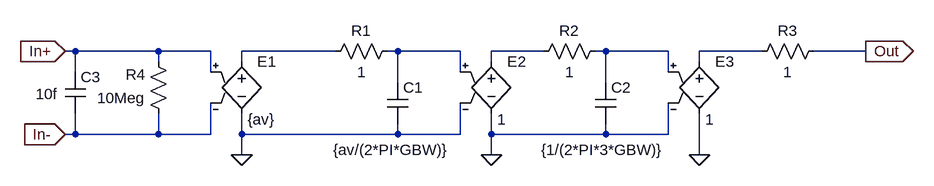
[diagram p0: schematic AO_2poles.asc]
AO_2poles.asc, the LTspice schematic file:
Version 4
SHEET 1 1188 680
WIRE -128 96 -144 96
WIRE 0 96 -128 96
WIRE 80 96 0 96
WIRE 272 96 128 96
WIRE 368 96 352 96
WIRE 464 96 368 96
WIRE 592 96 512 96
WIRE 688 96 672 96
WIRE 784 96 688 96
WIRE 928 96 832 96
WIRE 1088 96 1008 96
WIRE 0 112 0 96
WIRE 128 112 128 96
WIRE 512 112 512 96
WIRE 832 112 832 96
WIRE -128 128 -128 96
WIRE 80 128 80 96
WIRE 464 128 464 96
WIRE 784 128 784 96
WIRE 368 144 368 96
WIRE 688 144 688 96
WIRE -128 224 -128 192
WIRE -128 224 -144 224
WIRE 0 224 0 192
WIRE 0 224 -128 224
WIRE 80 224 80 176
WIRE 80 224 0 224
WIRE 128 224 128 192
WIRE 368 224 368 208
WIRE 368 224 128 224
WIRE 464 224 464 176
WIRE 464 224 368 224
WIRE 512 224 512 192
WIRE 688 224 688 208
WIRE 688 224 512 224
WIRE 784 224 784 176
WIRE 784 224 688 224
WIRE 128 256 128 224
WIRE 512 256 512 224
WIRE 832 256 832 192
FLAG 128 256 0
FLAG -144 96 In+
IOPIN -144 96 In
FLAG 1088 96 Out
IOPIN 1088 96 Out
FLAG -144 224 In-
IOPIN -144 224 In
FLAG 512 256 0
FLAG 832 256 0
SYMBOL e 128 96 R0
WINDOW 3 9 105 Left 2
SYMATTR Value {av}
SYMATTR InstName E1
SYMBOL res 368 80 R90
WINDOW 0 0 56 VBottom 2
WINDOW 3 32 56 VTop 2
SYMATTR InstName R1
SYMATTR Value 1
SYMBOL e 512 96 R0
WINDOW 3 9 105 Left 2
SYMATTR Value 1
SYMATTR InstName E2
SYMBOL res 688 80 R90
WINDOW 0 0 56 VBottom 2
WINDOW 3 32 56 VTop 2
SYMATTR InstName R2
SYMATTR Value 1
SYMBOL cap 672 144 R0
WINDOW 3 -83 104 Left 2
SYMATTR Value {1/(2*PI*3*GBW)}
SYMATTR InstName C2
SYMBOL e 832 96 R0
WINDOW 3 9 105 Left 2
SYMATTR Value 1
SYMATTR InstName E3
SYMBOL res 1024 80 R90
WINDOW 0 0 56 VBottom 2
WINDOW 3 32 56 VTop 2
SYMATTR InstName R3
SYMATTR Value 1
SYMBOL cap 352 144 R0
WINDOW 3 -83 104 Left 2
SYMATTR Value {av/(2*PI*GBW)}
SYMATTR InstName C1
SYMBOL res 16 208 R180
WINDOW 0 36 76 Left 2
WINDOW 3 36 40 Left 2
SYMATTR InstName R4
SYMATTR Value 10Meg
SYMBOL cap -144 128 R0
WINDOW 3 -45 34 Left 2
SYMATTR Value 10f
SYMATTR InstName C3

The netlist it stands for:
* AO_2poles.asc
E1 N001 0 In+ In- {av}
R1 N002 N001 1
E2 N003 0 N002 0 1
R2 N004 N003 1
C2 N004 0 {1/(2*PI*3*GBW)}
E3 N005 0 N004 0 1
R3 Out N005 1
C1 N002 0 {av/(2*PI*GBW)}
R4 In- In+ 10Meg
C3 In+ In- 10f
.backanno
.end